# Altium schematic sheet SD_Card_Adapter.SchDoc
size A4; Author: Wojciech Grędel; Revision: 1
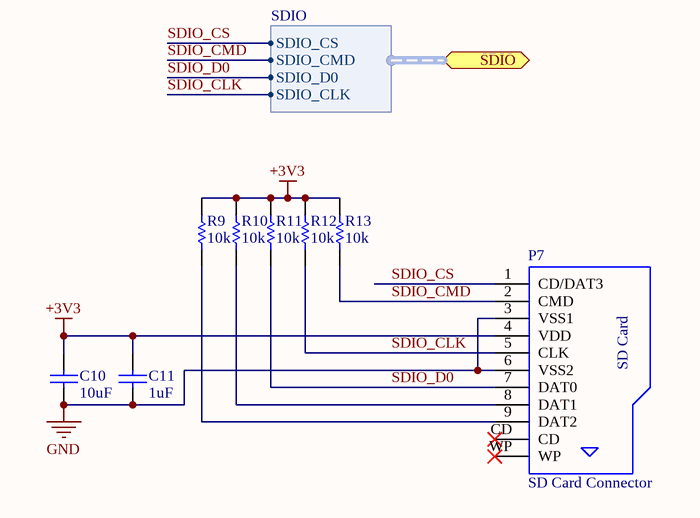
[diagram p0: SD_Card_Adapter.SchDoc]

## Parts
C10  value 10uF  [CAP_0805_IPC_MD]  (hidden comment: Cap)
C11  value 1uF  [CAP_0805_IPC_MD]  (hidden comment: Cap)
P7  SD Card Connector  [693061010911]
R9  value 10k  [RES_0805_IPC_MD]  (hidden comment: Res)
R10  value 10k  [RES_0805_IPC_MD]  (hidden comment: Res)
R11  value 10k  [RES_0805_IPC_MD]  (hidden comment: Res)
R12  value 10k  [RES_0805_IPC_MD]  (hidden comment: Res)
R13  value 10k  [RES_0805_IPC_MD]  (hidden comment: Res)

## Ports
SDIO (harness SDIO)

## Harnesses
SDIO: SDIO_CS, SDIO_CMD, SDIO_D0, SDIO_CLK

## Nets
+3V3: C10.2 C11.2 P7.4(VDD) R9.2 R10.2 R11.2 R12.2 R13.2
GND: C10.1 C11.1 P7.3(VSS1) P7.6(VSS2)
SDIO_CLK: P7.5(CLK) R12.1 ; port SDIO.SDIO_CLK
SDIO_CMD: P7.2(CMD) R13.1 ; port SDIO.SDIO_CMD
SDIO_CS: P7.1(CD/DAT3) ; port SDIO.SDIO_CS
SDIO_D0: P7.7(DAT0) R11.1 ; port SDIO.SDIO_D0
NetP7_8: P7.8(DAT1) R10.1
NetP7_9: P7.9(DAT2) R9.1

Not connected (* = marked no-connect by the designer): P7 CD* WP*

## Notes on the sheet
- (in symbol SD Card Connector) SD Card

## Library data of the parts
C10 = Cap: Capacitor; Manufacturer: Sansung; Supplier Part Number: CL21A106KOQNNNF; Supplier: TME
C11 = Cap: Capacitor; Manufacturer: Samsung; Supplier Part Number: CL21B105KOFNNNF; Supplier: TME
P7 = SD Card Connector: WR-CRD SD_Push and Push; Manufacturer: W¨ąrth Elektronik eiSos GmbH; Manufacturer: Adam Tech; ComponentLink1 Description: Manufacturer; ComponentLink2 Description: Datasheet; NoPins: 11; ComponentLink1URL: http://www.we-online.de; ComponentLink2URL: http://katalog.we-online.de/em/datasheet/693061010911.pdf; Created by: Karrer Zheng; Created Date: 10/10/2014; partNo: 693061010911; Supplier: TME; Supplier Part Number: SDP-09M-SG
R9-R13 = Res: Resistor; Supplier: *; Supplier Part Number: *; Manufacturer: *